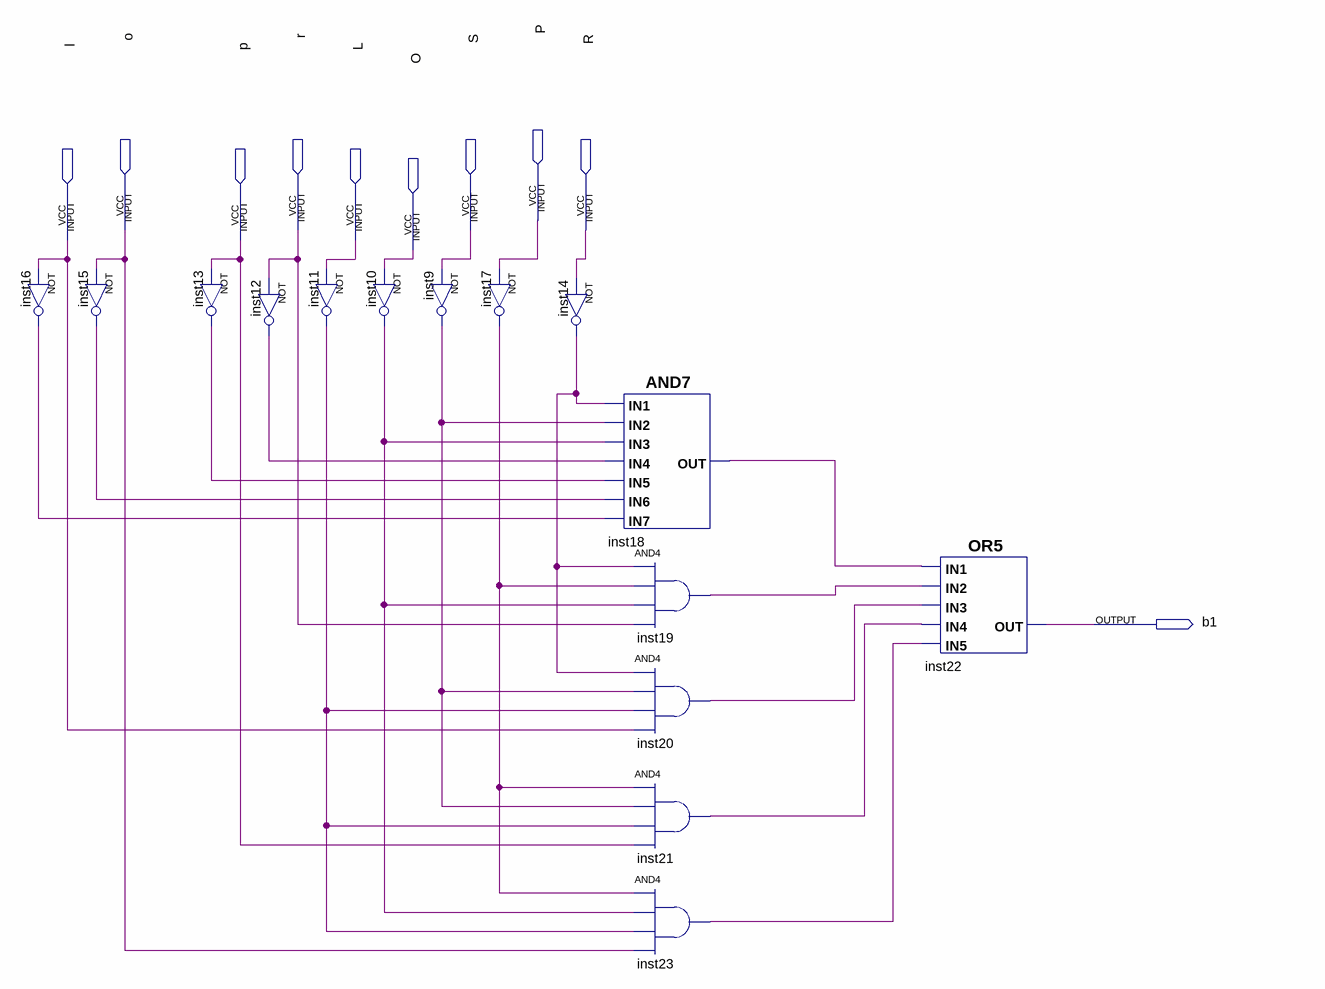
[diagram p0: schematic sheet]
// Quartus schematic Firstester.bdf as structural Verilog: 15 symbols, 10 pins
module Firstester (
  input  P,
  input  O,
  input  R,
  input  S,
  input  L,
  output b1
);

  wire inst9_out, inst10_out, inst11_out, inst12_out, inst13_out, inst14_out, inst15_out, inst16_out,
       inst17_out, inst18_out, inst19_out, inst20_out, inst21_out, inst23_out;

  not inst16 (inst16_out, L);
  not inst15 (inst15_out, O);
  not inst13 (inst13_out, P);
  not inst12 (inst12_out, R);
  not inst11 (inst11_out, L);
  not inst10 (inst10_out, O);
  not inst9 (inst9_out, S);
  not inst17 (inst17_out, P);
  not inst14 (inst14_out, R);
  and inst18 (inst18_out, inst14_out, inst9_out, inst10_out, inst12_out, inst13_out, inst15_out, inst16_out);
  and inst19 (inst19_out, inst14_out, inst17_out, inst10_out, R);
  and inst20 (inst20_out, inst14_out, inst9_out, inst11_out, L);
  and inst21 (inst21_out, inst17_out, inst9_out, inst11_out, P);
  and inst23 (inst23_out, inst17_out, inst10_out, inst11_out, O);
  or inst22 (b1, inst18_out, inst19_out, inst20_out, inst21_out, inst23_out);
endmodule
